# Altium schematic sheet MPBoard_L3_Relay2_ext.SchDoc
size A3; SheetNumber: 3; SheetTotal: 5
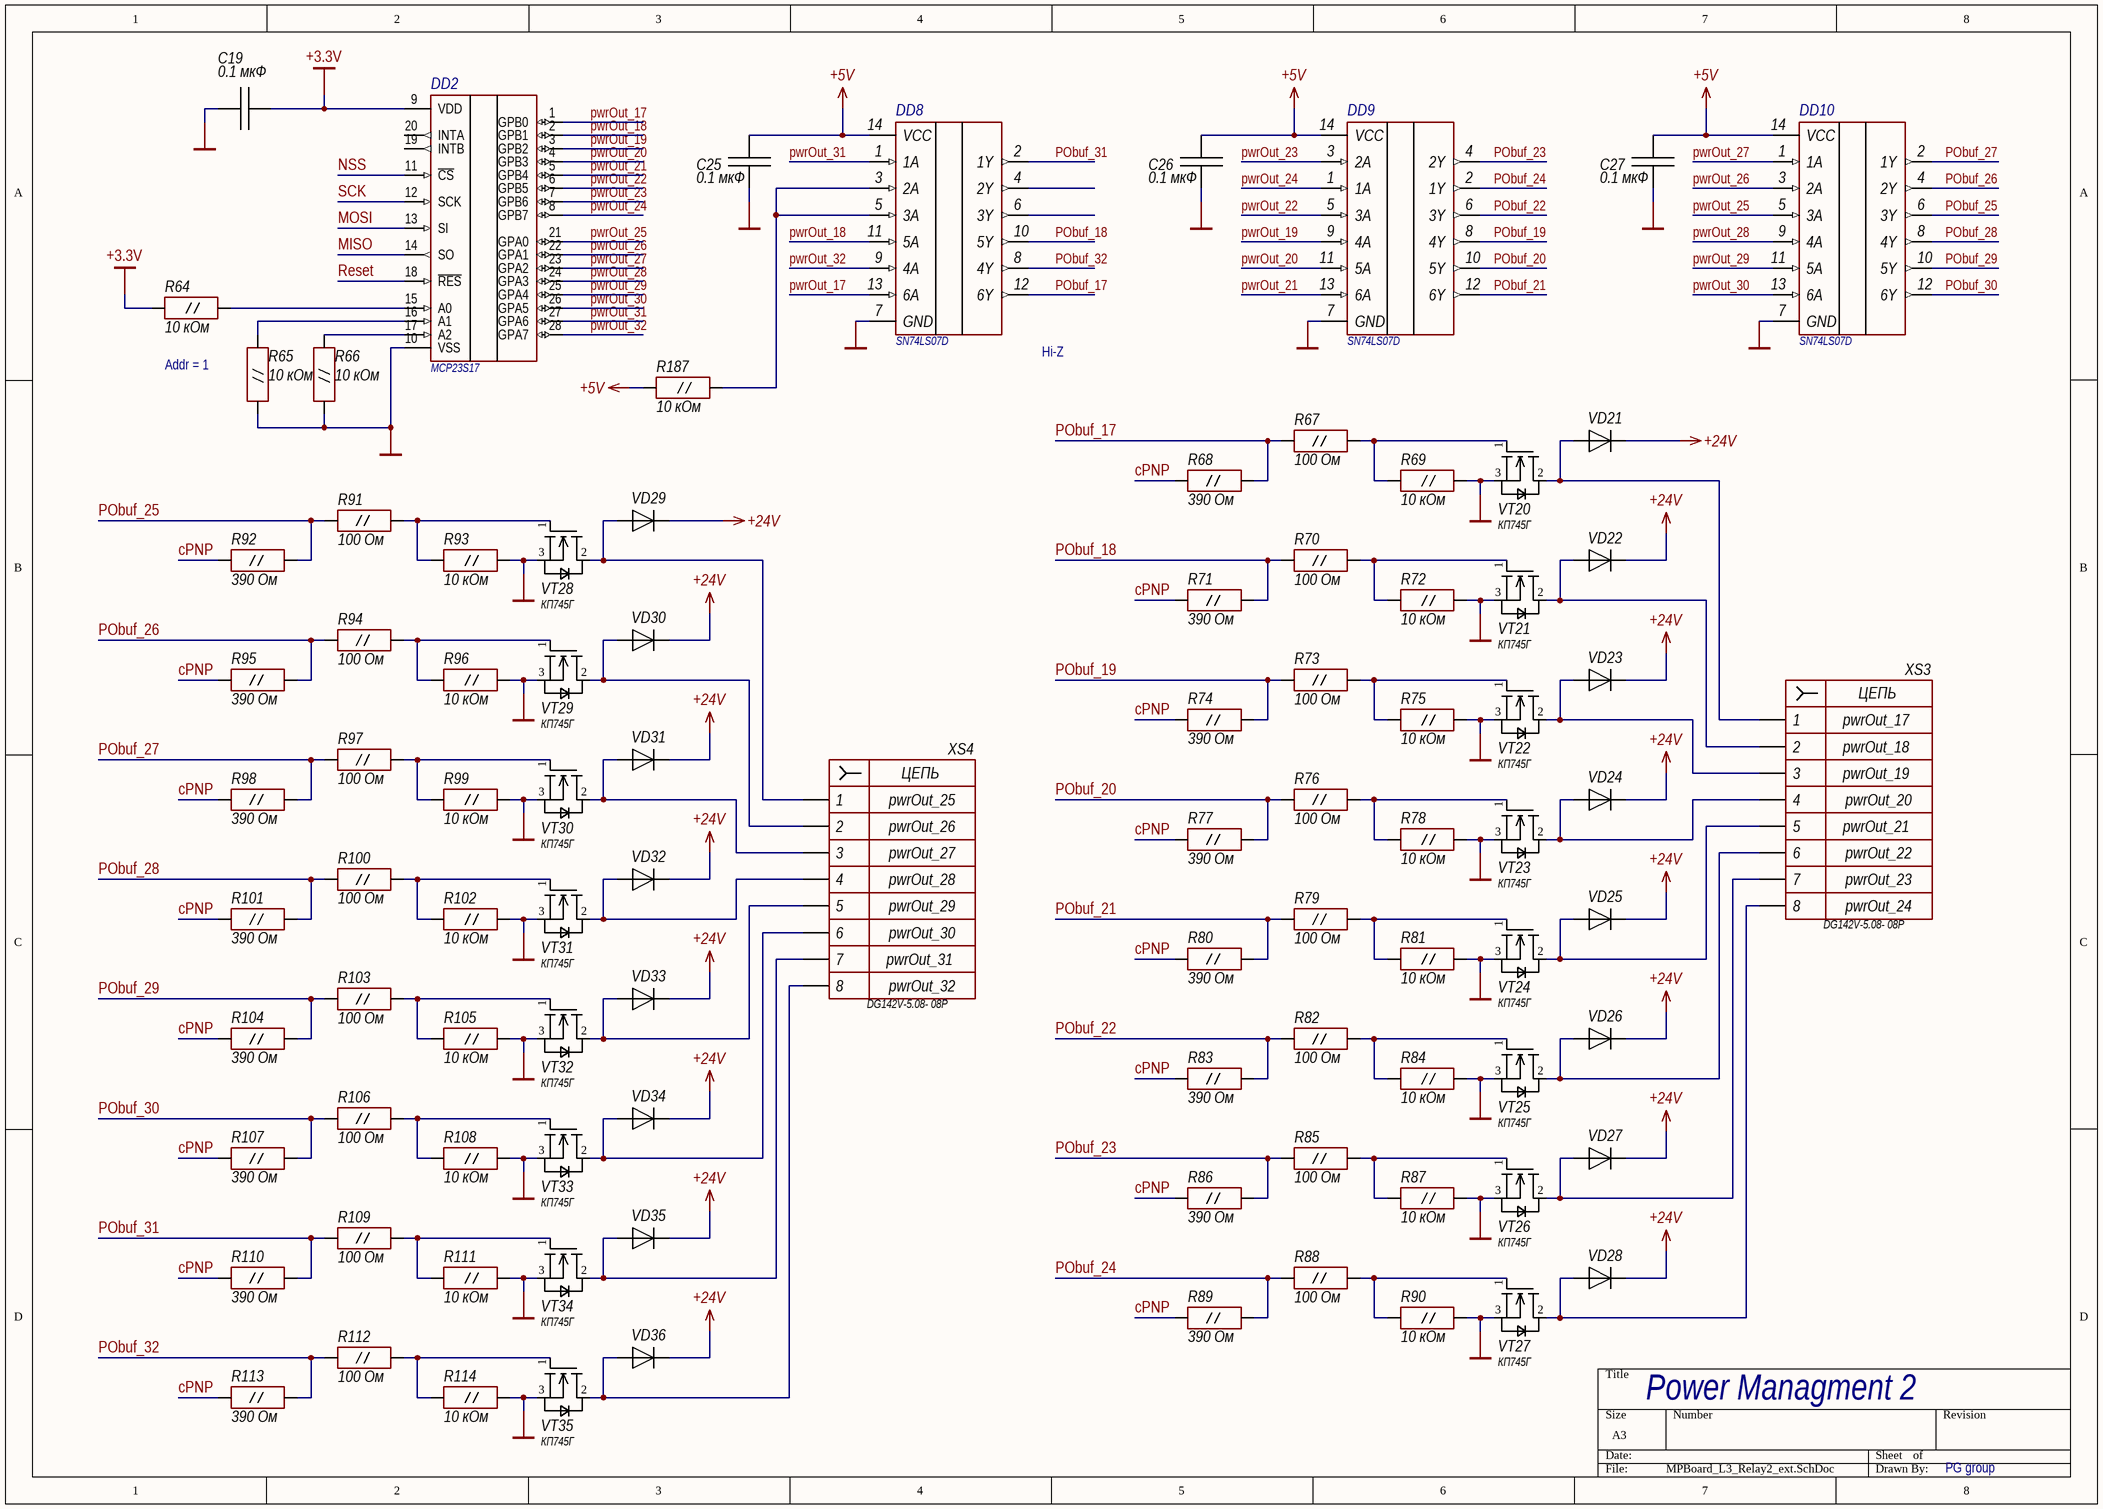
[diagram p0: MPBoard_L3_Relay2_ext.SchDoc]

## Parts
C19  0.1 мкФ  [CAP-0603]
C25  0.1 мкФ  [CAP-0603]
C26  0.1 мкФ  [CAP-0603]
C27  0.1 мкФ  [CAP-0603]
DD2  MCP23S17  [SOIC-28]
DD8  SN74LS07D  [SOIC-14]
DD9  SN74LS07D  [SOIC-14]
DD10  SN74LS07D  [SOIC-14]
R64  10 кОм  [RES-0603]
R65  10 кОм  [RES-0603]
R66  10 кОм  [RES-0603]
R67  100 Ом  [RES-0805]
R68  390 Ом  [RES-0805]
R69  10 кОм  [RES-0805]
R70  100 Ом  [RES-0805]
R71  390 Ом  [RES-0805]
R72  10 кОм  [RES-0805]
R73  100 Ом  [RES-0805]
R74  390 Ом  [RES-0805]
R75  10 кОм  [RES-0805]
R76  100 Ом  [RES-0805]
R77  390 Ом  [RES-0805]
R78  10 кОм  [RES-0805]
R79  100 Ом  [RES-0805]
R80  390 Ом  [RES-0805]
R81  10 кОм  [RES-0805]
R82  100 Ом  [RES-0805]
R83  390 Ом  [RES-0805]
R84  10 кОм  [RES-0805]
R85  100 Ом  [RES-0805]
R86  390 Ом  [RES-0805]
R87  10 кОм  [RES-0805]
R88  100 Ом  [RES-0805]
R89  390 Ом  [RES-0805]
R90  10 кОм  [RES-0805]
R91  100 Ом  [RES-0805]
R92  390 Ом  [RES-0805]
R93  10 кОм  [RES-0805]
R94  100 Ом  [RES-0805]
R95  390 Ом  [RES-0805]
R96  10 кОм  [RES-0805]
R97  100 Ом  [RES-0805]
R98  390 Ом  [RES-0805]
R99  10 кОм  [RES-0805]
R100  100 Ом  [RES-0805]
R101  390 Ом  [RES-0805]
R102  10 кОм  [RES-0805]
R103  100 Ом  [RES-0805]
R104  390 Ом  [RES-0805]
R105  10 кОм  [RES-0805]
R106  100 Ом  [RES-0805]
R107  390 Ом  [RES-0805]
R108  10 кОм  [RES-0805]
R109  100 Ом  [RES-0805]
R110  390 Ом  [RES-0805]
R111  10 кОм  [RES-0805]
R112  100 Ом  [RES-0805]
R113  390 Ом  [RES-0805]
R114  10 кОм  [RES-0805]
R187  10 кОм  [RES-0603]
VD21  HER108  [DIOD-MILS-400]  (value not drawn)
VD22  HER108  [DIOD-MILS-400]  (value not drawn)
VD23  HER108  [DIOD-MILS-400]  (value not drawn)
VD24  HER108  [DIOD-MILS-400]  (value not drawn)
VD25  HER108  [DIOD-MILS-400]  (value not drawn)
VD26  HER108  [DIOD-MILS-400]  (value not drawn)
VD27  HER108  [DIOD-MILS-400]  (value not drawn)
VD28  HER108  [DIOD-MILS-400]  (value not drawn)
VD29  HER108  [DIOD-MILS-400]  (value not drawn)
VD30  HER108  [DIOD-MILS-400]  (value not drawn)
VD31  HER108  [DIOD-MILS-400]  (value not drawn)
VD32  HER108  [DIOD-MILS-400]  (value not drawn)
VD33  HER108  [DIOD-MILS-400]  (value not drawn)
VD34  HER108  [DIOD-MILS-400]  (value not drawn)
VD35  HER108  [DIOD-MILS-400]  (value not drawn)
VD36  HER108  [DIOD-MILS-400]  (value not drawn)
VT20  КП745Г  [TO220S inline]
VT21  КП745Г  [TO220S inline]
VT22  КП745Г  [TO220S inline]
VT23  КП745Г  [TO220S inline]
VT24  КП745Г  [TO220S inline]
VT25  КП745Г  [TO220S inline]
VT26  КП745Г  [TO220S inline]
VT27  КП745Г  [TO220S inline]
VT28  КП745Г  [TO220S inline]
VT29  КП745Г  [TO220S inline]
VT30  КП745Г  [TO220S inline]
VT31  КП745Г  [TO220S inline]
VT32  КП745Г  [TO220S inline]
VT33  КП745Г  [TO220S inline]
VT34  КП745Г  [TO220S inline]
VT35  КП745Г  [TO220S inline]
XS3  DG142V-5.08- 08P  NET6: pwrOut_22  NET5: pwrOut_21  NET1: pwrOut_17  NET2: pwrOut_18  NET3: pwrOut_19  NET4: pwrOut_20  NET7: pwrOut_23  NET8: pwrOut_24  [DG142V-5.08-08]
XS4  DG142V-5.08- 08P  NET6: pwrOut_30  NET5: pwrOut_29  NET1: pwrOut_25  NET2: pwrOut_26  NET3: pwrOut_27  NET4: pwrOut_28  NET7: pwrOut_31  NET8: pwrOut_32  [DG142V-5.08-08]

## Nets
+3.3V: C19.2 DD2.9(VDD) R64.2
+5V: C25.2 C26.2 C27.2 DD8.14(VCC) DD9.14(VCC) DD10.14(VCC) R187.2
+24V: VD21.2 VD22.2 VD23.2 VD24.2 VD25.2 VD26.2 VD27.2 VD28.2 VD29.2 VD30.2 VD31.2 VD32.2 VD33.2 VD34.2 VD35.2 VD36.2
GND: C19.1 C25.1 C26.1 C27.1 DD2.10(VSS) DD8.7(GND) DD9.7(GND) DD10.7(GND) R65.1 R66.1 R69.1 R72.1 R75.1 R78.1 R81.1 R84.1 R87.1 R90.1 R93.1 R96.1 R99.1 R102.1 R105.1 R108.1 R111.1 R114.1 VT20.3(S) VT21.3(S) VT22.3(S) VT23.3(S) VT24.3(S) VT25.3(S) VT26.3(S) VT27.3(S) VT28.3(S) VT29.3(S) VT30.3(S) VT31.3(S) VT32.3(S) VT33.3(S) VT34.3(S) VT35.3(S)
cPNP: R68.1 R71.1 R74.1 R77.1 R80.1 R83.1 R86.1 R89.1 R92.1 R95.1 R98.1 R101.1 R104.1 R107.1 R110.1 R113.1
MISO: DD2.14(SO)
MOSI: DD2.13(SI)
NSS: DD2.11(~{CS})
PObuf_17: DD8.12(6Y) R67.1 R68.2
PObuf_18: DD8.10(5Y) R70.1 R71.2
PObuf_19: DD9.8(4Y) R73.1 R74.2
PObuf_20: DD9.10(5Y) R76.1 R77.2
PObuf_21: DD9.12(6Y) R79.1 R80.2
PObuf_22: DD9.6(3Y) R82.1 R83.2
PObuf_23: DD9.4(2Y) R85.1 R86.2
PObuf_24: DD9.2(1Y) R88.1 R89.2
PObuf_25: DD10.6(3Y) R91.1 R92.2
PObuf_26: DD10.4(2Y) R94.1 R95.2
PObuf_27: DD10.2(1Y) R97.1 R98.2
PObuf_28: DD10.8(4Y) R100.1 R101.2
PObuf_29: DD10.10(5Y) R103.1 R104.2
PObuf_30: DD10.12(6Y) R106.1 R107.2
PObuf_31: DD8.2(1Y) R109.1 R110.2
PObuf_32: DD8.8(4Y) R112.1 R113.2
pwrOut_17: DD2.1(GPB0) DD8.13(6A)
pwrOut_18: DD2.2(GPB1) DD8.11(5A)
pwrOut_19: DD2.3(GPB2) DD9.9(4A)
pwrOut_20: DD2.4(GPB3) DD9.11(5A)
pwrOut_21: DD2.5(GPB4) DD9.13(6A)
pwrOut_22: DD2.6(GPB5) DD9.5(3A)
pwrOut_23: DD2.7(GPB6) DD9.3(2A)
pwrOut_24: DD2.8(GPB7) DD9.1(1A)
pwrOut_25: DD2.21(GPA0) DD10.5(3A)
pwrOut_26: DD2.22(GPA1) DD10.3(2A)
pwrOut_27: DD2.23(GPA2) DD10.1(1A)
pwrOut_28: DD2.24(GPA3) DD10.9(4A)
pwrOut_29: DD2.25(GPA4) DD10.11(5A)
pwrOut_30: DD2.26(GPA5) DD10.13(6A)
pwrOut_31: DD2.27(GPA6) DD8.1(1A)
pwrOut_32: DD2.28(GPA7) DD8.9(4A)
Reset: DD2.18(~{RES})
SCK: DD2.12(SCK)
NetDD2_15: DD2.15(A0) R64.1
NetDD2_16: DD2.16(A1) R65.2
NetDD2_17: DD2.17(A2) R66.2
NetDD8_3: DD8.3(2A) DD8.5(3A) R187.1
NetR67_2: R67.2 R69.2 VT20.1(G)
NetR70_2: R70.2 R72.2 VT21.1(G)
NetR73_2: R73.2 R75.2 VT22.1(G)
NetR76_2: R76.2 R78.2 VT23.1(G)
NetR79_2: R79.2 R81.2 VT24.1(G)
NetR82_2: R82.2 R84.2 VT25.1(G)
NetR85_2: R85.2 R87.2 VT26.1(G)
NetR88_2: R88.2 R90.2 VT27.1(G)
NetR91_2: R91.2 R93.2 VT28.1(G)
NetR94_2: R94.2 R96.2 VT29.1(G)
NetR97_2: R97.2 R99.2 VT30.1(G)
NetR100_2: R100.2 R102.2 VT31.1(G)
NetR103_2: R103.2 R105.2 VT32.1(G)
NetR106_2: R106.2 R108.2 VT33.1(G)
NetR109_2: R109.2 R111.2 VT34.1(G)
NetR112_2: R112.2 R114.2 VT35.1(G)
NetVD21_1: VD21.1 VT20.2(D) XS3.1
NetVD22_1: VD22.1 VT21.2(D) XS3.2
NetVD23_1: VD23.1 VT22.2(D) XS3.3
NetVD24_1: VD24.1 VT23.2(D) XS3.4
NetVD25_1: VD25.1 VT24.2(D) XS3.5
NetVD26_1: VD26.1 VT25.2(D) XS3.6
NetVD27_1: VD27.1 VT26.2(D) XS3.7
NetVD28_1: VD28.1 VT27.2(D) XS3.8
NetVD29_1: VD29.1 VT28.2(D) XS4.1
NetVD30_1: VD30.1 VT29.2(D) XS4.2
NetVD31_1: VD31.1 VT30.2(D) XS4.3
NetVD32_1: VD32.1 VT31.2(D) XS4.4
NetVD33_1: VD33.1 VT32.2(D) XS4.5
NetVD34_1: VD34.1 VT33.2(D) XS4.6
NetVD35_1: VD35.1 VT34.2(D) XS4.7
NetVD36_1: VD36.1 VT35.2(D) XS4.8

Not connected (* = marked no-connect by the designer): DD2 19(INTB) 20(INTA); DD8 4(2Y) 6(3Y)

## Notes on the sheet
- Addr = 1
- (near DD8) Hi-Z
- Power Managment 2
- PG group
- (in symbol XS8) ЦЕПЬ

## Library data of the parts
C19 C25-C27 = C: Конденсатор; MFPartNum: C0603C101K5GAC; IPSPartNumber: 65-724-19; Dielectric: X7R; MF: KEMET; Tolerance: ± 10 %; Voltage: 50 В; ValueDescription: Конденсатор 0.1 мкФ ± 10 % 50 В X7R SMD 0603; Package: SMD 0603; Value: 0.1 мкФ; HelpURL: https://content.kemet.com/datasheets/KEM_C1002_X7R_SMD.pdf; NameRUS: Конденсатор
DD2 = DD_MCP23S17: I/O Expander 16 SPI; MF: Microchip; MFPartNum: MCP23S17; Package: SOIC-28; HelpURL: https://www.chipdip.ru/product/mcp23s17-e-so
DD8-DD10 = DD_SN74LS07D: 6-ch, 4.75_5.25V bipolar buffers with OC outputs; MF: Texas Instruments; MFPartNum: SN74LS07D; Package: SOIC-14; HelpURL: https://www.chipdip.by/product/sn74ls07d
R64-R66 R187 = R_0.125W: Резистор 0.1 W; MFPartNum: D11/CRCW0603; MF: Vishay; Tolerance: ± 1 %; ValueDescription: Резистор 10 кОм ± 1 % SMD 0603; Package: SMD 0603; Value: 10 кОм; HelpURL: https://www.vishay.com/docs/20035/dcrcwe3.pdf; IPSPartNumber: *; NameRUS: Резистор
R67 R70 R73 R76 R79 R82 R85 R88 R91 R94 R97 R100 R103 R106 R109 R112 = R_0.125W: Резистор 0.125 W; MFPartNum: CRCW080513K3FKEA; MF: Vishay; Tolerance: ± 1 %; ValueDescription: Резистор 100 Ом ± 1 % SMD 0805; Package: SMD 0805; Value: 100 Ом; HelpURL: https://www.vishay.com/docs/20035/dcrcwe3.pdf; IPSPartNumber: *; NameRUS: Резистор
R68 R71 R74 R77 R80 R83 R86 R89 R92 R95 R98 R101 R104 R107 R110 R113 = R_0.125W: Резистор 0.125 W; MFPartNum: CRCW080513K3FKEA; MF: Vishay; Tolerance: ± 1 %; ValueDescription: Резистор 390 Ом ± 1 % SMD 0805; Package: SMD 0805; Value: 390 Ом; HelpURL: https://www.vishay.com/docs/20035/dcrcwe3.pdf; IPSPartNumber: *; NameRUS: Резистор
R69 R72 R75 R78 R81 R84 R87 R90 R93 R96 R99 R102 R105 R108 R111 R114 = R_0.125W: Резистор 0.125 W; MFPartNum: CRCW080513K3FKEA; MF: Vishay; Tolerance: ± 1 %; ValueDescription: Резистор 10 кОм ± 1 % SMD 0805; Package: SMD 0805; Value: 10 кОм; HelpURL: https://www.vishay.com/docs/20035/dcrcwe3.pdf; IPSPartNumber: *; NameRUS: Резистор
VD21-VD36 = VD: Диод Выпрямительный; MFPartNum: HER108G; MF: Taiwan Semiconductor; ValueDescription: Диод выпрямительный HER108 DO-204AL-2; HelpURL: https://eu.mouser.com/ProductDetail/?qs=tHU%2FlV7kTySN6KO41tibrA%3D%3D; Value: HER108; Package: DO-204AL-2; NameRUS: Диод выпрямительный
VT20-VT35 = VT_N-MOSFET: MOSFET; MF: Интеграл; Voltage: 100 В; Current: 15 А; Analogue: IRL530N; MFPartNum: КП745Г; Package: TO-220; HelpURL: https://belchip.by/product/?selected_product=10167
XS3 XS4 = XS8: розетка 8 контактов; MFPartNum: DG142V-5.08- 08P-14-00A(H); MF: Degson Electronics; ValueDescription: Разъем розетка DG142V-5.08- 08P; NameRUS: Разъем розетка; Value: DG142V-5.08- 08P; HelpURL: https://www.chipdip.by/product0/8077186472; IPSPartNumber: *